# Altium schematic sheet MainBoard.SchDoc
size A3; SheetNumber: 4; SheetTotal: 8
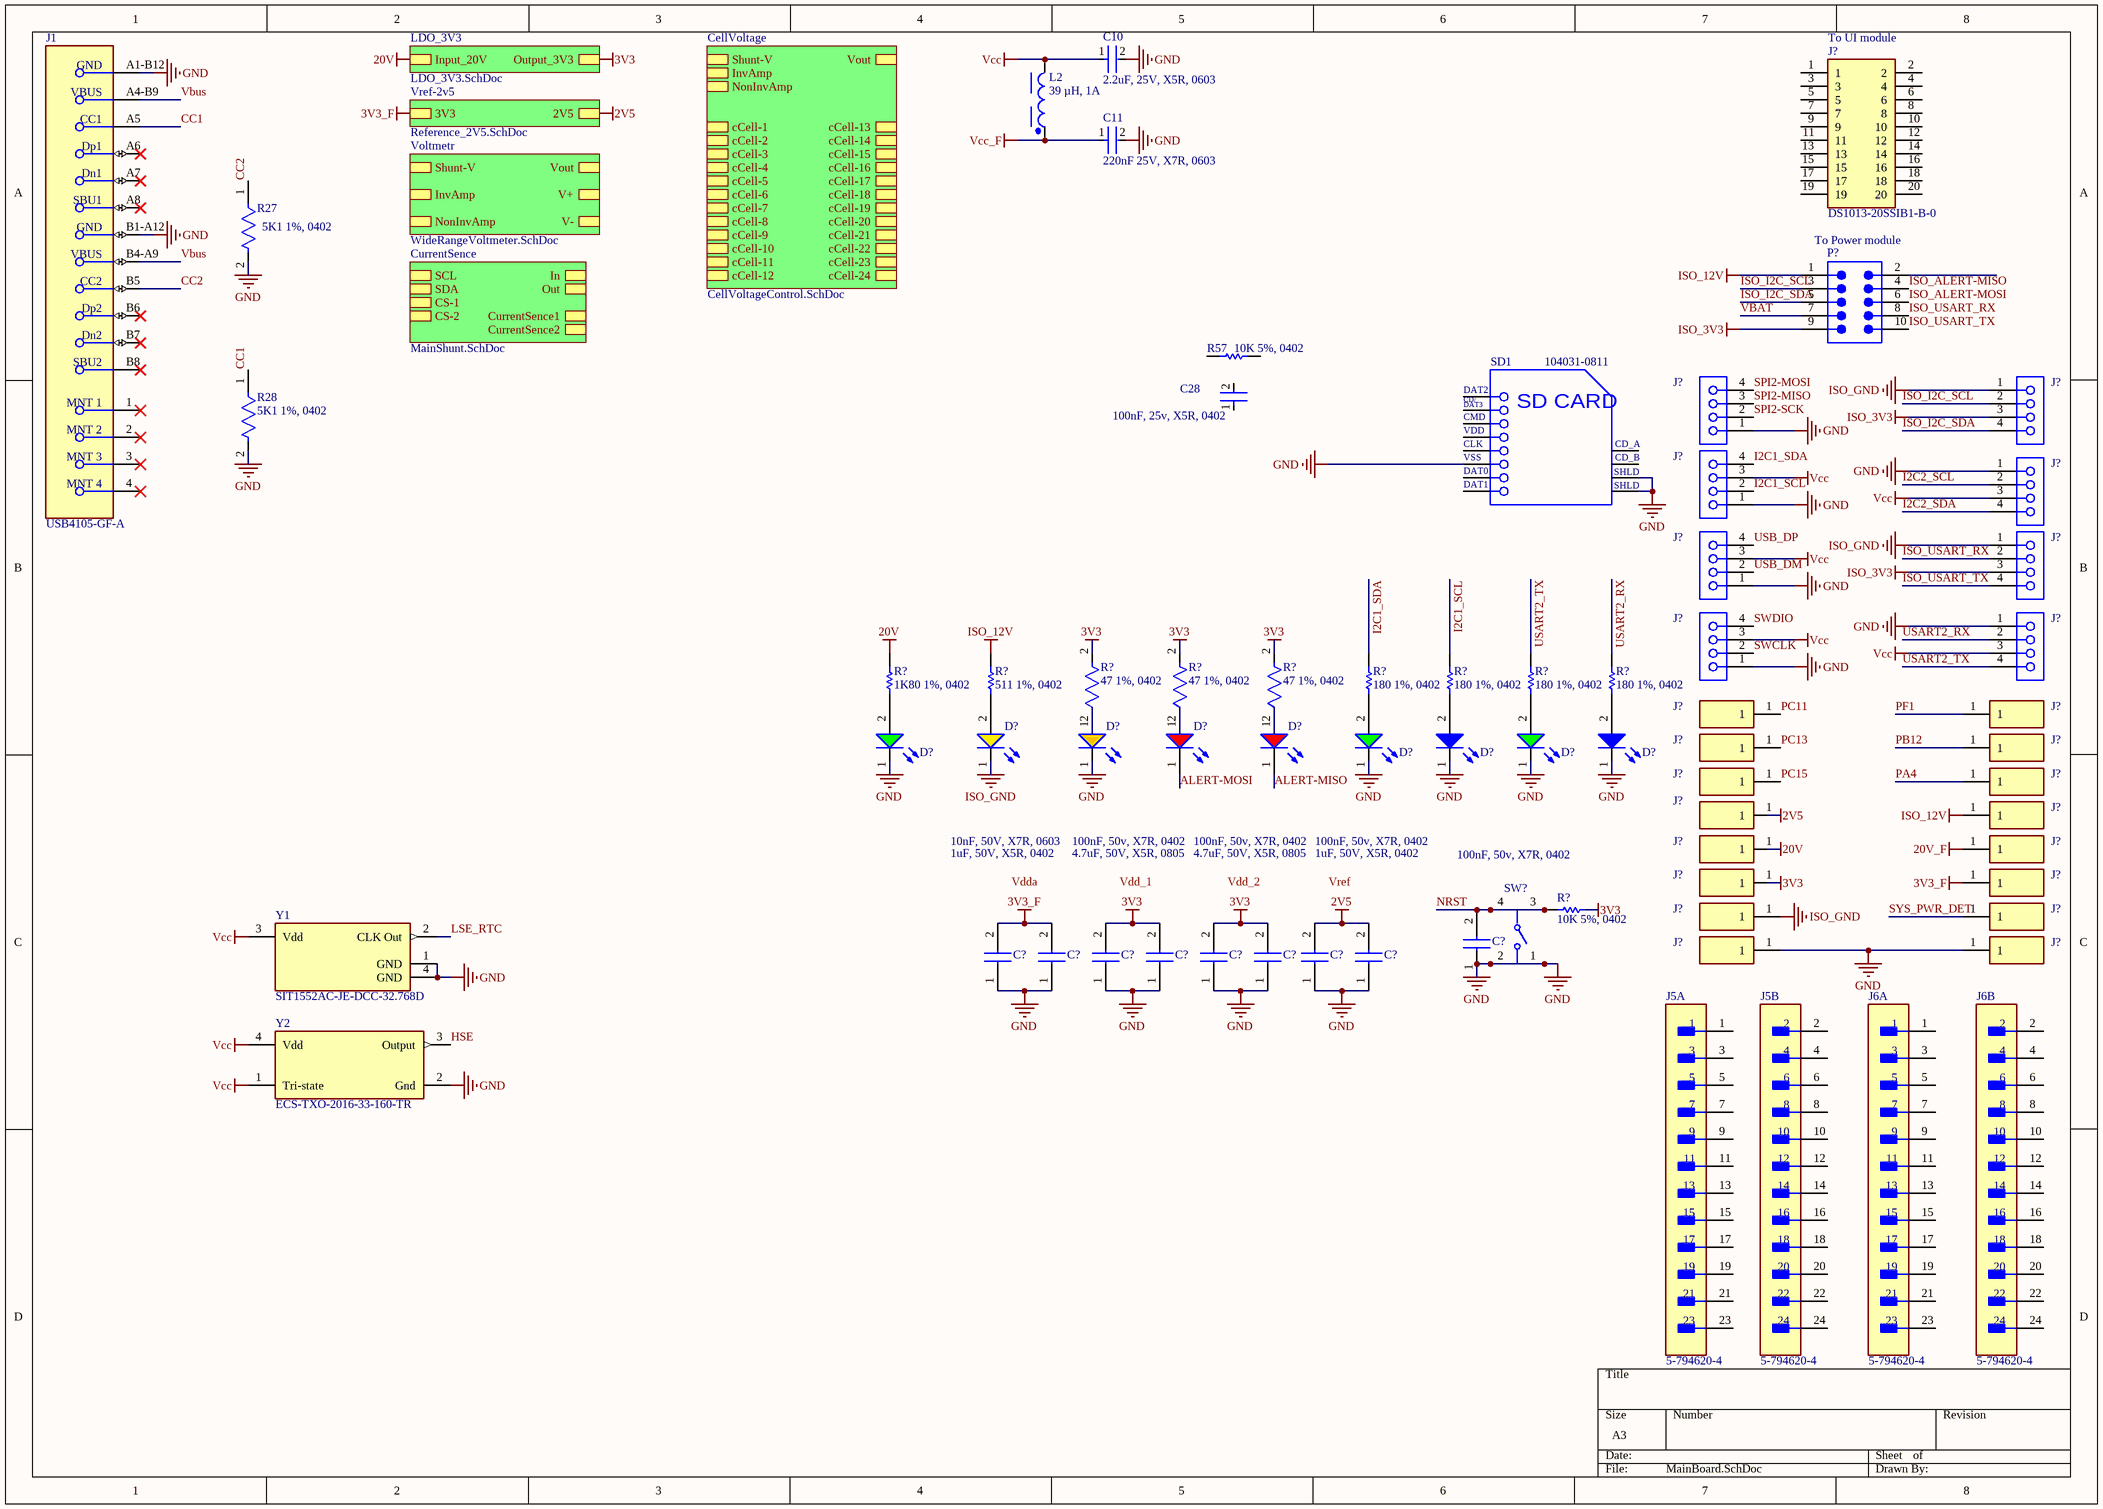
[diagram p0: MainBoard.SchDoc]

## Parts
(Parts that share a designator on the sheet are numbered #1, #2 ... from top to bottom, then left to right.)
C10  2.2uF, 25V, X5R, 0603  [FP-GRM188-0_1-e0_2_0_5-MFG]
C11  220nF 25V, X7R, 0603  [FP-GCM188-0_1-IPC_B]
C28  100nF, 25v, X5R, 0402  [FP-GRM155-0_05-IPC_C]
C?#1  100nF, 50v, X7R, 0402  [CAPC2012X88N]  (value not drawn)
C?#2  10nF, 50V, X7R, 0603  [CAPC1608X87N]  (value not drawn)
C?#3  1uF, 50V, X5R, 0402  [GRM15x]  (value not drawn)
C?#4  100nF, 50v, X7R, 0402  [CAPC2012X88N]  (value not drawn)
C?#5  4.7uF, 50V, X5R, 0805  [CAPC2012X145N]  (value not drawn)
C?#6  100nF, 50v, X7R, 0402  [CAPC2012X88N]  (value not drawn)
C?#7  4.7uF, 50V, X5R, 0805  [CAPC2012X145N]  (value not drawn)
C?#8  100nF, 50v, X7R, 0402  [CAPC2012X88N]  (value not drawn)
C?#9  1uF, 50V, X5R, 0402  [GRM15x]  (value not drawn)
D?#1  150060GS75000  [WL-SMCW_0603_150060xx75000]  (value not drawn)
D?#2  150060YS75000  [WL-SMCW_0603_150060xx75000]  (value not drawn)
D?#3  150060AS75000  [WL-SMCW_0603_150060xx75000]  (value not drawn)
D?#4  150060RS75000  [WL-SMCW_0603_150060xx75000]  (value not drawn)
D?#5  150060RS75000  [WL-SMCW_0603_150060xx75000]  (value not drawn)
D?#6  150060GS75000  [WL-SMCW_0603_150060xx75000]  (value not drawn)
D?#7  150060BS75000  [WL-SMCW_0603_150060xx75000]  (value not drawn)
D?#8  150060GS75000  [WL-SMCW_0603_150060xx75000]  (value not drawn)
D?#9  150060BS75000  [WL-SMCW_0603_150060xx75000]  (value not drawn)
J1  USB4105-GF-A  [FP-USB4105-GF-A-MFG]
J5  5-794620-4  [FP-5-794620-4-MFG]  (parts A,B of 2)
J6  5-794620-4  [FP-5-794620-4-MFG]  (parts A,B of 2)
J?#1  DS1013-20SSIB1-B-0  [SHDR20W69P254X254_2X10_3300X910X955P]
J?#2  61300411821  [61300411821]  (value not drawn)  (net tie, no BOM)
J?#3  61300411821  [61300411821]  (value not drawn)  (net tie, no BOM)
J?#4  61300411821  [61300411821]  (value not drawn)  (net tie, no BOM)
J?#5  61300411821  [61300411821]  (value not drawn)  (net tie, no BOM)
J?#6  61300411821  [61300411821]  (value not drawn)  (net tie, no BOM)
J?#7  61300411821  [61300411821]  (value not drawn)  (net tie, no BOM)
J?#8  61300411821  [61300411821]  (value not drawn)  (net tie, no BOM)
J?#9  61300411821  [61300411821]  (value not drawn)  (net tie, no BOM)
J?#10  TestPad  [TestPad]  (value not drawn)  (no BOM)
J?#11  TestPad  [TestPad]  (value not drawn)  (no BOM)
J?#12  TestPad  [TestPad]  (value not drawn)  (no BOM)
J?#13  TestPad  [TestPad]  (value not drawn)  (no BOM)
J?#14  TestPad  [TestPad]  (value not drawn)  (no BOM)
J?#15  TestPad  [TestPad]  (value not drawn)  (no BOM)
J?#16  TestPad  [TestPad]  (value not drawn)  (no BOM)
J?#17  TestPad  [TestPad]  (value not drawn)  (no BOM)
J?#18  TestPad  [TestPad]  (value not drawn)  (no BOM)
J?#19  TestPad  [TestPad]  (value not drawn)  (no BOM)
J?#20  TestPad  [TestPad]  (value not drawn)  (no BOM)
J?#21  TestPad  [TestPad]  (value not drawn)  (no BOM)
J?#22  TestPad  [TestPad]  (value not drawn)  (no BOM)
J?#23  TestPad  [TestPad]  (value not drawn)  (no BOM)
J?#24  TestPad  [TestPad]  (value not drawn)  (no BOM)
J?#25  TestPad  [TestPad]  (value not drawn)  (no BOM)
L2  39 µH, 1A  [WE-PD_7345]
P?  61201021621  [61201021621]  (value not drawn)
R27  5K1 1%, 0402  [FP-ERJ2RK-IPC_A]
R28  5K1 1%, 0402  [FP-ERJ2RK-IPC_A]
R57  10K 5%, 0402  [RESC1005X40X25ML05T05]
R?#1  180 1%, 0402  [RESC1005X40X25NL05T05]
R?#2  180 1%, 0402  [RESC1005X40X25NL05T05]
R?#3  180 1%, 0402  [RESC1005X40X25NL05T05]
R?#4  180 1%, 0402  [RESC1005X40X25NL05T05]
R?#5  1K80 1%, 0402  [RESC1005X40X25NL10T10]
R?#6  511 1%, 0402  [RESC1005X40X25ML05T05]
R?#7  47 1%, 0402  [FP-ERJ2RK-IPC_C]
R?#8  47 1%, 0402  [FP-ERJ2RK-IPC_C]
R?#9  47 1%, 0402  [FP-ERJ2RK-IPC_C]
R?#10  10K 5%, 0402  [RESC1005X40X25ML05T05]
SD1  104031-0811  [MOLX-104031-0811_V]
SW?  PTS810SJM250SMTRLFS  [FP-PTS810SJM250SMTRLFS-MFG]  (value not drawn)
Y1  SIT1552AC-JE-DCC-32.768D  [FP-SiT1552-J-MFG]
Y2  ECS-TXO-2016-33-160-TR  [FP-TXO-2016-MFG]

## Sub-sheets
CellVoltage = CellVoltageControl.SchDoc: InvAmp, NonInvAmp, Shunt-V, Vout, cCell-1, cCell-2, cCell-3, cCell-4, cCell-5, cCell-6, cCell-7, cCell-8, cCell-9, cCell-10, cCell-11, cCell-12, cCell-13, cCell-14, cCell-15, cCell-16, cCell-17, cCell-18, cCell-19, cCell-20, cCell-21, cCell-22, cCell-23, cCell-24
CurrentSence = MainShunt.SchDoc: CurrentSence1, CurrentSence2, CS-1, CS-2, SDA, SCL, In, Out
LDO_3V3 = LDO_3V3.SchDoc: Output_3V3, Input_20V
Voltmetr = WideRangeVoltmeter.SchDoc: InvAmp, NonInvAmp, V-, V+, Shunt-V, Vout
Vref-2v5 = Reference_2V5.SchDoc: 2V5, 3V3

## Nets
2V5: C?#8.2 C?#9.2 J?#16.1 ; sheet Vref-2v5/2V5
3V3: C?#4.2 C?#5.2 C?#6.2 C?#7.2 J?#20.1 R?#7.2 R?#8.2 R?#9.2 R?#10.1 ; sheet LDO_3V3/Output_3V3
3V3_F: C?#2.2 C?#3.2 J?#21.1 ; sheet Vref-2v5/3V3
20V: J?#18.1 R?#5.2 ; sheet LDO_3V3/Input_20V
20V_F: J?#19.1
GND: C10.2 C11.2 C?#1.1 C?#2.1 C?#3.1 C?#4.1 C?#5.1 C?#6.1 C?#7.1 C?#8.1 C?#9.1 D?#1.1(K) D?#3.1(K) D?#6.1(K) D?#7.1(K) D?#8.1(K) D?#9.1(K) J1.A1-B12(GND) J1.B1-A12(GND) J?#3.1 J?#4.1 J?#5.1 J?#7.1 J?#8.1 J?#9.1 J?#24.1 J?#25.1 R27.2 R28.2 SD1.6(VSS2) SD1.11(SHLD1) SD1.12(SHLD2) SW?.1 SW?.2 Y1.1(GND) Y1.4(GND) Y2.2(Gnd)
ISO_3V3: J?#2.3 J?#6.3 P?.9
ISO_12V: J?#17.1 P?.1 R?#6.2
ISO_GND: D?#2.1(K) J?#2.1 J?#6.1 J?#22.1
Vcc: C10.1 J?#4.3 J?#5.3 J?#7.3 J?#8.3 J?#9.3 L2.2 Y1.3(Vdd) Y2.1(Tri-state) Y2.4(Vdd)
Vcc_F: C11.1 L2.1
ALERT-MISO: D?#5.1(K)
ALERT-MOSI: D?#4.1(K)
CC1: J1.A5(CC1) R28.1
CC2: J1.B5(CC2) R27.1
HSE: Y2.3(Output)
I2C1_SCL: J?#5.2 R?#2.1
I2C1_SDA: J?#5.4 R?#1.1
I2C2_SCL: J?#4.2
I2C2_SDA: J?#4.4
ISO_ALERT-MISO: P?.4
ISO_ALERT-MOSI: P?.6
ISO_I2C_SCL: J?#2.2 P?.3
ISO_I2C_SDA: J?#2.4 P?.5
ISO_USART_RX: J?#6.2 P?.8
ISO_USART_TX: J?#6.4 P?.10
LSE_RTC: Y1.2(CLK_Out)
NRST: C?#1.2 R?#10.2 SW?.3 SW?.4
PA4: J?#15.1
PB12: J?#13.1
PC11: J?#10.1
PC13: J?#12.1
PC15: J?#14.1
PF1: J?#11.1
SPI2-MISO: J?#3.3
SPI2-MOSI: J?#3.4
SPI2-SCK: J?#3.2
SWCLK: J?#9.2
SWDIO: J?#9.4
SYS_PWR_DET: J?#23.1
USART2_RX: J?#8.2 R?#4.1
USART2_TX: J?#8.4 R?#3.1
USB_DM: J?#7.2
USB_DP: J?#7.4
VBAT: P?.7
Vbus: J1.A4-B9(VBUS) J1.B4-A9(VBUS)
NetD?#1_2: D?#1.2(A) R?#5.1
NetD?#2_2: D?#2.2(A) R?#6.1
NetD?#3_2: D?#3.2(A) R?#7.1
NetD?#4_2: D?#4.2(A) R?#8.1
NetD?#5_2: D?#5.2(A) R?#9.1
NetD?#6_2: D?#6.2(A) R?#1.2
NetD?#7_2: D?#7.2(A) R?#2.2
NetD?#8_2: D?#8.2(A) R?#3.2
NetD?#9_2: D?#9.2(A) R?#4.2

Not connected (* = marked no-connect by the designer): C28 1 2; J1 1(MNT_1)* 2(MNT_2)* 3(MNT_3)* 4(MNT_4)* A6(Dp1)* A7(Dn1)* A8(SBU1)* B6(Dp2)* B7(Dn2)* B8(SBU2)*; J5 1 2 3 4 5 6 7 8 9 10 11 12 13 14 15 16 17 18 19 20 21 22 23 24; J6 1 2 3 4 5 6 7 8 9 10 11 12 13 14 15 16 17 18 19 20 21 22 23 24; J?#1 1 2 3 4 5 6 7 8 9 10 11 12 13 14 15 16 17 18 19 20; P? 2; R57 1 2; SD1 1(CD/DAT3) 2(CMD) 3(VSS1) 4(VDD) 5(CLK) 7(DAT0) 8(DAT1) 9(CD_A) 10(CD_B)

## Notes on the sheet
- (near J?#1) To UI module
- To Power module
- 1uF, 50V, X5R, 0402
- 10nF, 50V, X7R, 0603
- 4.7uF, 50V, X5R, 0805
- 100nF, 50v, X7R, 0402
- Vdda
- Vdd_1
- Vdd_2
- Vref
- (in symbol CMP-2000-05825-1) DAT2; CD/; DAT3; SD CARD; VSS; SHLD

## Library data of the parts
C10 = CMP-2006-02820-2: Chip Multilayer Ceramic Capacitors for General Purpose, 0603, 2.2uF, X5R, 15%, 10%, 25V; Number of Pins: 2; Dielectric: X5R; Tolerance: 10%; Case Code (Imperial): 0603; Thickness: 0.035inch; Case/Package: 0603; Lead Free: Lead Free; Mount: Surface Mount; Material: Ceramic; Depth: 0.8mm; Voltage: 25V; Capacitance: 2.2uF; Min Operating Temperature: -55°C; Package Quantity: 4000; REACH SVHC: No SVHC; Resistor Type: Ceramic; Packaging: Tape and Reel; Case Code (Metric): 1608; Max Operating Temperature: 85°C; Width: 0.8mm; Termination: SMD/SMT; Voltage Rating: 25V; Length: 1.6mm; Voltage Rating (DC): 25V; Height: 0.8mm; Radiation Hardening: No; Weight: 0.000222oz
C11 = CMP-2006-02366-2: Ceramic Capacitor for Automotive 220nF  ±10% 25VDC X7R 0603 Paper T/R; Capacitance: 220nF; Mount: Surface Mount; Ratings: AEC-Q200; Case/Package: 0603; Packaging: Tape and Reel; Radiation Hardening: No; Voltage: 25V; Dielectric: X7R; Case Code (Imperial): 0603; Max Operating Temperature: 125°C; Min Operating Temperature: -55°C; Depth: 0.8mm; Termination: SMD/SMT; Package Quantity: 1; Case Code (Metric): 1608; Thickness: 0.035inch; Voltage Rating: 25V; Tolerance: 10%; Voltage Rating (DC): 25V; Height: 0.8mm; Lead Free: Lead Free; Length: 1.6mm; Width: 0.031inch
C28 = CMP-06035-003661-1: Chip Multilayer Ceramic Capacitors for General Purpose, 0402, 0.10uF, X7R, 15%, 10%, 25V; Length: 1mm; Depth: 0.5mm; Dielectric: X7R; Voltage Rating: 25V; Lead Free: Lead Free; Case Code (Imperial): 0402; Voltage: 25V; Min Operating Temperature: -55°C; Tolerance: 10%; Dielectric Material: Ceramic; Voltage Rating (DC): 25V; Max Operating Temperature: 125°C; Capacitance: 100nF; Thickness: 0.022inch; Case/Package: 0402; Height: 0.5mm; Resistor Type: Ceramic; Weight: 0.000212oz; Case Code (Metric): 1005; Package Quantity: 10000; Termination: SMD/SMT; Width: 0.02inch; Mount: Surface Mount; Packaging: Tape and Reel
C?#1 C?#4 C?#6 C?#8 = C0805C104M5RAC: Capacitor; Manufacturer_Name: KEMET; Datasheet Link: https://connect.kemet.com:7667/gateway/IntelliData-ComponentDocumentation/1.0/download/specsheet/C0805C104M5RAC%7bBULK%7d; Height: 0.88mm; Manufacturer_Part_Number: C0805C104M5RAC; Mouser Part Number: 80-C0805C104M5RAC; Mouser Price/Stock: https://www.mouser.co.uk/ProductDetail/KEMET/C0805C104M5RAC?qs=VOOUd%252Bza08rWzt4y8eXMuQ%3D%3D; Arrow Part Number: C0805C104M5RAC; Arrow Price/Stock: https://www.arrow.com/en/products/c0805c104m5rac/kemet-corporation?utm_currency=USD&region=nac
C?#2 = C0603C103J5RAC: Capacitor; Manufacturer_Name: KEMET; Datasheet Link: https://www.kemet.com/specsheet/C0603C103J5RAC%7BBULK%7D; Height: 0.87mm; Manufacturer_Part_Number: C0603C103J5RAC; Mouser Part Number: 80-C0603C103J5RAC; Mouser Price/Stock: https://www.mouser.co.uk/ProductDetail/KEMET/C0603C103J5RAC?qs=Zjfhvh7dXTOjKlZBdCXdvg%3D%3D; Arrow Part Number: C0603C103J5RAC; Arrow Price/Stock: https://www.arrow.com/en/products/c0603c103j5rac/kemet-corporation?region=nac
C?#3 C?#9 = GRM155R61H105KE05J: Capacitor; Manufacturer_Name: Murata Electronics; Datasheet Link: https://search.murata.co.jp/Ceramy/image/img/A01X/G101/ENG/GRM155R61H105KE05-01A.pdf; Height: 0.33mm; Manufacturer_Part_Number: GRM155R61H105KE05J; Mouser Part Number: 81-GRM155R61H105KE5J; Mouser Price/Stock: https://www.mouser.co.uk/ProductDetail/Murata-Electronics/GRM155R61H105KE05J?qs=d0WKAl%252BL4KZilUxqJ3m7lA%3D%3D; Arrow Part Number: GRM155R61H105KE05J; Arrow Price/Stock: https://www.arrow.com/en/products/grm155r61h105ke05j/murata-manufacturing?region=nac
C?#5 C?#7 = GRM21BR61H475ME51L: Capacitor; Manufacturer_Name: Murata Electronics; Datasheet Link: https://search.murata.co.jp/Ceramy/image/img/A01X/G101/ENG/GRM21BR61H475ME51-01A.pdf; Height: 1.45mm; Manufacturer_Part_Number: GRM21BR61H475ME51L; Mouser Part Number: 81-GRM21BR61H475M51L; Mouser Price/Stock: https://www.mouser.co.uk/ProductDetail/Murata-Electronics/GRM21BR61H475ME51L?qs=eeBpzGFlv%252B%2Fg0wAeHy0eJw%3D%3D; Arrow Part Number: GRM21BR61H475ME51L; Arrow Price/Stock: https://www.arrow.com/en/products/grm21br61h475me51l/murata-manufacturing?region=nac
D?#1 D?#6 D?#8 = CMP-1426-00002-4: 430mcd Colorless transparence 520nm Emerald 140° LED0603 Light Emitting Diodes (LED) ROHS; Peak Wavelength: 515nm; Forward Current: 100mA; Reverse Voltage: 5V; Output Current: 10µA; Power Dissipation: 105mW; Lens Style: Clear, Rectangular; Dominant Wavelength: 525nm; Color: Green; Test Current: 20mA; Max Junction Temperature (Tj): 95°C; Forward Voltage: 3.2V; Width: 800µm; Max Operating Temperature: 85°C; Case Code (Metric): 1608; Luminous Intensity: 430mcd; Lead Free: Lead Free; Case/Package: 0603; Case Code (Imperial): 0603; Mount: Surface Mount; Max Reverse Voltage (DC): 5V; Packaging: Tape and Reel; RoHS: Compliant; Viewing Angle: 140°; REACH SVHC: Unknown; Min Operating Temperature: -40°C; Height: 700µm; Wavelength: 525nm; Length: 1.6mm
D?#2 = CMP-1426-00005-3: WL-SMCW SMT Mono-Color Chip LED Waterclear; Power Dissipation: 72mW; Reverse Voltage: 5V; Forward Voltage: 2V; Test Current: 20mA; Luminous Intensity: 120mcd; Max Junction Temperature (Tj): 95°C; Wavelength: 590nm; Color: Yellow; Forward Current: 100mA; Lens Style: Clear, Rectangular; Viewing Angle: 140°; Peak Wavelength: 595nm; Case Code (Metric): 1608; Length: 1.6mm; Max Reverse Voltage (DC): 5V; Case Code (Imperial): 0603; Dominant Wavelength: 590nm; Mount: Surface Mount; Max Operating Temperature: 85°C; Min Operating Temperature: -40°C; Packaging: Tape and Reel; REACH SVHC: Unknown; Width: 800µm; Case/Package: 0603; Height: 700µm; RoHS: Compliant
D?#3 = CMP-03913-89970694-2: WL-SMCW SMT Mono-Color Chip LED Waterclear; Luminous Intensity: 130mcd; Max Reverse Voltage (DC): 5V; Viewing Angle: 140°; Dominant Wavelength: 605nm; Forward Current: 100mA; Forward Voltage: 2V; Peak Wavelength: 610nm; RoHS: Compliant; Min Operating Temperature: -40°C; Wavelength: 605nm; Max Operating Temperature: 85°C; Packaging: Tape and Reel
D?#4 D?#5 = CMP-1426-00001-4: LED Low-Power Uni-Color Red 630nm 2V 2-Pin Chip 0603(1608Metric) T/R; Max Junction Temperature (Tj): 95°C; Dominant Wavelength: 625nm; Lens Style: Clear, Rectangular; Viewing Angle: 140°; Forward Current: 100mA; Max Reverse Voltage (DC): 5V; Luminous Intensity: 250mcd; Test Current: 20mA; Power Dissipation: 72mW; Max Operating Temperature: 85°C; Mount: Surface Mount; Height: 700µm; Packaging: Tape and Reel; REACH SVHC: Unknown; Case Code (Metric): 1608; Peak Wavelength: 630nm; Forward Voltage: 2V; Case/Package: 0603; Color: Red; RoHS: Compliant; Width: 800µm; Reverse Voltage: 5V; Min Operating Temperature: -40°C; Wavelength: 625nm; Case Code (Imperial): 0603; Length: 1.6mm
D?#7 D?#9 = CMP-1426-00003-4: Led, Blue, 470 Nm, 3.2 V, 30 Ma, 145 Mcd Rohs Compliant: Yes; Peak Wavelength: 465nm; Dominant Wavelength: 470nm; Power Dissipation: 105mW; Viewing Angle: 140°; Test Current: 20mA; Max Junction Temperature (Tj): 95°C; Forward Current: 100mA; Reverse Voltage: 5V; Luminous Intensity: 145mcd; Lens Style: Clear, Rectangular; Forward Voltage: 3.2V; RoHS: Compliant; Min Operating Temperature: -40°C; REACH SVHC: Unknown; Max Operating Temperature: 85°C; Width: 800µm; Case Code (Imperial): 0603; Case Code (Metric): 1608; Max Reverse Voltage (DC): 5V; Height: 700µm; Case/Package: 0603; Mount: Surface Mount; Packaging: Tape and Reel; Color: Blue; Wavelength: 470nm; Length: 1.6mm
J1 = CMP-245163-000001-1: CONN RCPT USB2.0 TYPEC 5A; Manufacturer: GCT; Voltage Rating: 20V; Is Female: yes; Current Rating: 5/6.25/1.25/0.25A; Number Of Contacts: 16; Conn Orientation: Right Angle; Device Class L1: Connectors; Category: Conn; Lead Free: Yes; RoHS: TRUE; Temperature Range High: +85°C; Digikey Description: CONN RCPT USB2.0 TYPEC 5A; Device Class L3: unset; ComponentLink2Description: Datasheet; Manufacturer Part Number: USB4105-GF-A; Package: 0; Usb Standard: USB 2.0; Device Class L2: USB Connectors; Automotive: No; Temperature Range Low: -40°C; Height: 3.46mm; Temperature: -40°C to +85°C; Contact Material: Gold,Nickel; ComponentLink2URL: https://gct.co/files/drawings/usb4105.pdf; Octopart: https://octopart.com/usb4105-gf-a-gct-106627878
J5 J6 = CMP-03790-39517589-1: 5-794620-4 Conn Power HDR 24 POS 3mm Solder RA Thru-Hole 24 Terminal 1 Port Frame; Manufacturer Lifecycle Status: ACTIVE; Number of Contacts: 24; PCB Mounting Orientation: Right Angle; Contact Style: Pin; VDE Tested: Yes; Current Rating: 5A; Voltage Rating: 250V; Sealable: No; Plating Thickness: 8.89µm; Approvals: CSA; Number of Ports: 1; PCB Thickness: 1.6002mm; Row Spacing: 118µm; Contact Retention: Without; Connector System: Wire-to-Board; Plating: Gold; Pitch: 2.9972mm; Gender: Male; Lifecycle Status: Production; Flammability Rating: UL94 V-0; RoHS: Compliant; Packaging: Bulk; Fastening Type: Ramp; ELV: Compliant; Radiation Hardening: No; Lead Free: Lead Free; Housing Material: Nylon; Number of Rows: 2; Connector Type: Pin; Contact Current Rating: 5A; Operating Supply Voltage: 250V; Number of Power Positions: 24; Max Operating Temperature: 105°C; Circuit Application: Power; Housing Color: Black; Max Voltage Rating (AC): 250V; Number of Terminals: 24; Termination: Solder; Min Operating Temperature: -40°C; Lead Pitch: 3mm; Height: 8.93mm; Length: 40mm; Orientation: Right Angle; Mount: Through Hole; Contact Plating: Gold, Tin; NexarPartId: 39517589; Depth: 11.92mm; Color: Black; Number of Positions: 24; Contact Material: Brass
J?#1 = DS1013-20SSIB1-B-0: Connector; Manufacturer_Name: Connfly; Datasheet Link: https://www.tme.eu/Document/e9117e1c80532ff2c20cc520b4694ed9/DS1013.pdf; Height: 9.55mm; Manufacturer_Part_Number: DS1013-20SSIB1-B-0
J?#2-J?#9 = CMP-1502-01316-3: NexarPartId: 61924712; Contact Resistance: 20mΩ; Gender: Female; Current Rating: 3A; Operating Supply Voltage: 250V; RoHS: Non-Compliant; Number of Pins: 4; Orientation: Vertical; Lead Pitch: 2.54mm
J?#10-J?#25 = 61300111121: Connector; Manufacturer_Name: Wurth Elektronik; Datasheet Link: https://katalog.we-online.de/em/datasheet/6130xx11121.pdf; Height: 8.89mm; Manufacturer_Part_Number: 61300111121; Mouser Part Number: 710-61300111121; Mouser Price/Stock: https://www.mouser.co.uk/ProductDetail/Wurth-Elektronik/61300111121?qs=PhR8RmCirEaRH5Ck%252B2lRLQ%3D%3D
L2 = CMP-0227-00153-2: NexarPartId: 29930417; Max DC Current: 1.11A; Shielding: Shielded; Inductance: 39µH; Self Resonant Frequency: 11MHz; DC Resistance (DCR): 145mΩ; Tolerance: 20%; Ambient Temperature Range Low: -40°C; Width: 7.3mm; Length: 7.3mm; Number of Pins: 2; Packaging: Tape & Reel; Height: 4.5mm; Ambient Temperature Range High: 85°C; Max Operating Temperature: 125°C; Depth: 7.3mm; Min Operating Temperature: -40°C; RoHS: Compliant; Current Rating: 1.11A
P? = CMP-1502-00007-2: NexarPartId: 8917783; Number of Contacts: 10; Voltage Rating (DC): 250V; Insulation Resistance: 1GΩ; Current Rating: 3A; Row Spacing: 2.54mm; Contact Resistance: 20mΩ; Connector Type: Male Pin; Gender: Male; Flammability Rating: UL94 V-0; Termination: Solder; Width: 20.36mm; Length: 20.36mm; Housing Material: PBT; Operating Supply Voltage: 250V; Min Operating Temperature: -40°C; Lead Free: Lead Free; Insulation Material: PBT; Orientation: Vertical; RoHS: Compliant; Voltage Rating: 250V; Number of Pins: 10; Height: 8.85mm; REACH SVHC: Unknown; Contact Material: Copper; Contact Gender: Male; Color: Black; Mount: Through Hole; Contact Plating: Gold; Lead Pitch: 2.54mm; Number of Positions: 10; Pitch: 2.54mm; Max Operating Temperature: 105°C; Number of Rows: 2
R27 R28 = CMP-2002-01158-2: RES SMD 5.1K OHM 1% 1/10W 0402; Voltage Rating: 50V; Temperature Coefficient: 100ppm/°C; Resistance: 5.1kR; Power Rating: 100mW; Min Operating Temperature: -55°C; Technology: THICK FILM; Military Standard: Not; Depth: 0.5mm; Contact Plating: Tin; Tolerance: 1%; Construction: Rectangular; Length: 1mm; Case/Package: 0402; Lead Free: Lead Free; RoHS Compliant: Yes; Termination: SMD/SMT; Height: 0.35mm; Max Operating Temperature: 155°C; Case Code (Imperial): 0402; Number of Terminations: 2; Packaging: Tape and Reel; Case Code (Metric): 1005; Width: 0.5mm; Max Power Dissipation: 100mW; Package Quantity: 10000; Resistance Tolerance: 1%; REACH SVHC: No SVHC; Mount: Surface Mount; Series: ERJ; Voltage Rating (DC): 50V; Weight: 2.8E-05oz; Resistor Type: Thick Film
R57 R?#10 = CMP-2002-00433-1: Part Number: ERJ-2GEJ103X; Manufacturer: Panasonic
R?#1-R?#4 = CMP-2002-01127-1: Manufacturer: Panasonic; Part Number: ERJ2RKF1800X
R?#5 = CMP-2002-05845-1: Part Number: ERA-2AED182X; Manufacturer: Panasonic
R?#6 = CMP-2002-00976-1: Part Number: ERJ-2RKF5113X; Manufacturer: Panasonic
R?#7-R?#9 = CMP-1011-00360-3: RES SMD 47 OHM 1% 1/10W 0402; Resistance: 47R; Power Rating: 100mW; Temperature Coefficient: 100ppm/°C; Voltage Rating (DC): 50V; Case Code (Imperial): 0402; Width: 0.02inch; Height: 0.35mm; Features: Automotive AEC-Q200; Case/Package: 0402; RoHS Compliant: Yes; Lead Free: Lead Free; Case Code (Metric): 1005; Technology: THICK FILM; Termination: SMD/SMT; Tolerance: 1%; Resistance Tolerance: 1%; Max Operating Temperature: 155°C; Construction: Rectangular; Mount: Surface Mount; Min Operating Temperature: -55°C; Max Power Dissipation: 100mW; Number of Terminations: 2; Military Standard: Not; REACH SVHC: No SVHC; Resistor Type: Thick Film; Contact Plating: Tin; Package Quantity: 1; Series: ERJ; Packaging: Tape and Reel; Voltage Rating: 50V; Weight: 2.8E-05oz; Length: 1mm; Number of Pins: 2; Depth: 0.5mm
SD1 = CMP-2000-05825-1: Micro SD Card, RA, -25 to 85 degC, 8-Pin SMD, RoHS, Tape and Reel; Voltage Rating: 10VAC/DC; Number of Contacts: 8; Insertion - Extraction Style: Push-Pull; Pitch: 1.1mm; Mating Cycles: 10000; Brand: Molex; Current Rating: 500mA; Manufacturer URL: http://www.molex.com/; Card Type: microSD; Mounting Type: Standard; Height: 1.42mm; Mounting Technology: SurfaceMount; Contact Plating: Gold; Product Category: MemoryCardConnectors; Package Description: 8-Pin Surface Mount Device, Body 11.95 x 11.4 mm, Pitch 1.1 mm; Datasheet URL: http://www.molex.com/pdm_docs/sd/1040310811_sd.pdf; Termination Style: SMD; Length: 11.4mm; Housing Material: LiquidCrystalPolymer(LCP); Orientation: RightAngle; RoHS: True; Contact Material: PhosphorBronze; Datasheet Version: Rev. E, 04/2006; Packaging: Reel; Manufacturer: Molex; Series: 104031; Product: CardConnectors; Number of Rows: 1Row; Package Reference: 104031-0811
SW? = CMP-10040-000001-2: SWITCH TACTILE SPST-NO 0.05A 16V; Throw Configuration: SPST; Operating Force: 160gf; Actuator Type: Standard; Switch Travel: 0.15mm; Switch Function: Off-Mom; Max Current Rating: 50mA; Mechanical Life: 150000Cycles; Illumination Type: Non-Illuminated; Package Quantity: 2900; Depth: 4.6mm; Mount: Surface Mount; Packaging: Tape and Reel; Length: 3.2mm; RoHS Compliant: Yes; Case/Package: SMD/SMT; Voltage Rating (DC): 16V; Min Operating Temperature: -40°C; Termination: J-Bend; Lead Free: Lead Free; Contact Plating: Silver; Orientation: Straight; Max Operating Temperature: 85°C; Current Rating: 50mA; Color: Black
Y1 = CMP-25159-260295-1: MEMS OSC TCXO 32.7680KHZ LVCMOS; Frequency Stability: 5ppm; Frequency: 32.768kHz; Min Operating Temperature: 0°C; Length: 0.061inch; Mount: Surface Mount; Max Operating Temperature: 70°C; Width: 0.033inch; RoHS Compliant: Yes; Series: SiT1552; Packaging: Cut Tape; Height: 0.024inch
Y2 = CMP-40224-000008-1: XTAL OSC TCXO 16MHZ 3.3V SMD; Manufacturer: ECS; Max Supply Voltage: 3.63V; Max Supply Current: 7mA; Stability: 2ppm; Min Supply Voltage: 2.97V; Load Capacitance: 15pF; Frequency: 16MHz; Device Class L1: Passive Components; Manufacturer Part Number: ECS-TXO-2016-33-160-TR; Digikey Description: XTAL OSC TCXO 16MHZ 3.3V SMD; Device Class L3: Oscillators; Category: Crys; Lead Free: Yes; Temperature: -40°C to +85°C; RoHS: TRUE; ComponentLink2Description: Datasheet; Octopart: https://octopart.com/ecs-txo-2016-33-160-tr-ecs+international-102811109; ComponentLink2URL: https://ecsxtal.com/store/pdf/ECS-TXO-2016.pdf; Temperature Range High: +85°C; Height: 0.8mm; Device Class L2: Crystals / Oscillators; Package: TXO-2016; Temperature Range Low: -40°C; Series: TXO-2016; Automotive: No